# Altium schematic sheet 03 RK808.SchDoc
size 420 x 297 mm; Address1: Address1; Address2: Address2; Address3: Address3; Address4: Address4; DocumentNumber: АБВГ.123456.001 Э3; SheetNumber: 3; SheetTotal: 23; Scale: 1:1; DocumentType: Схема электрическая принципиальная; FirstReferrence: АБВГ.123456.001
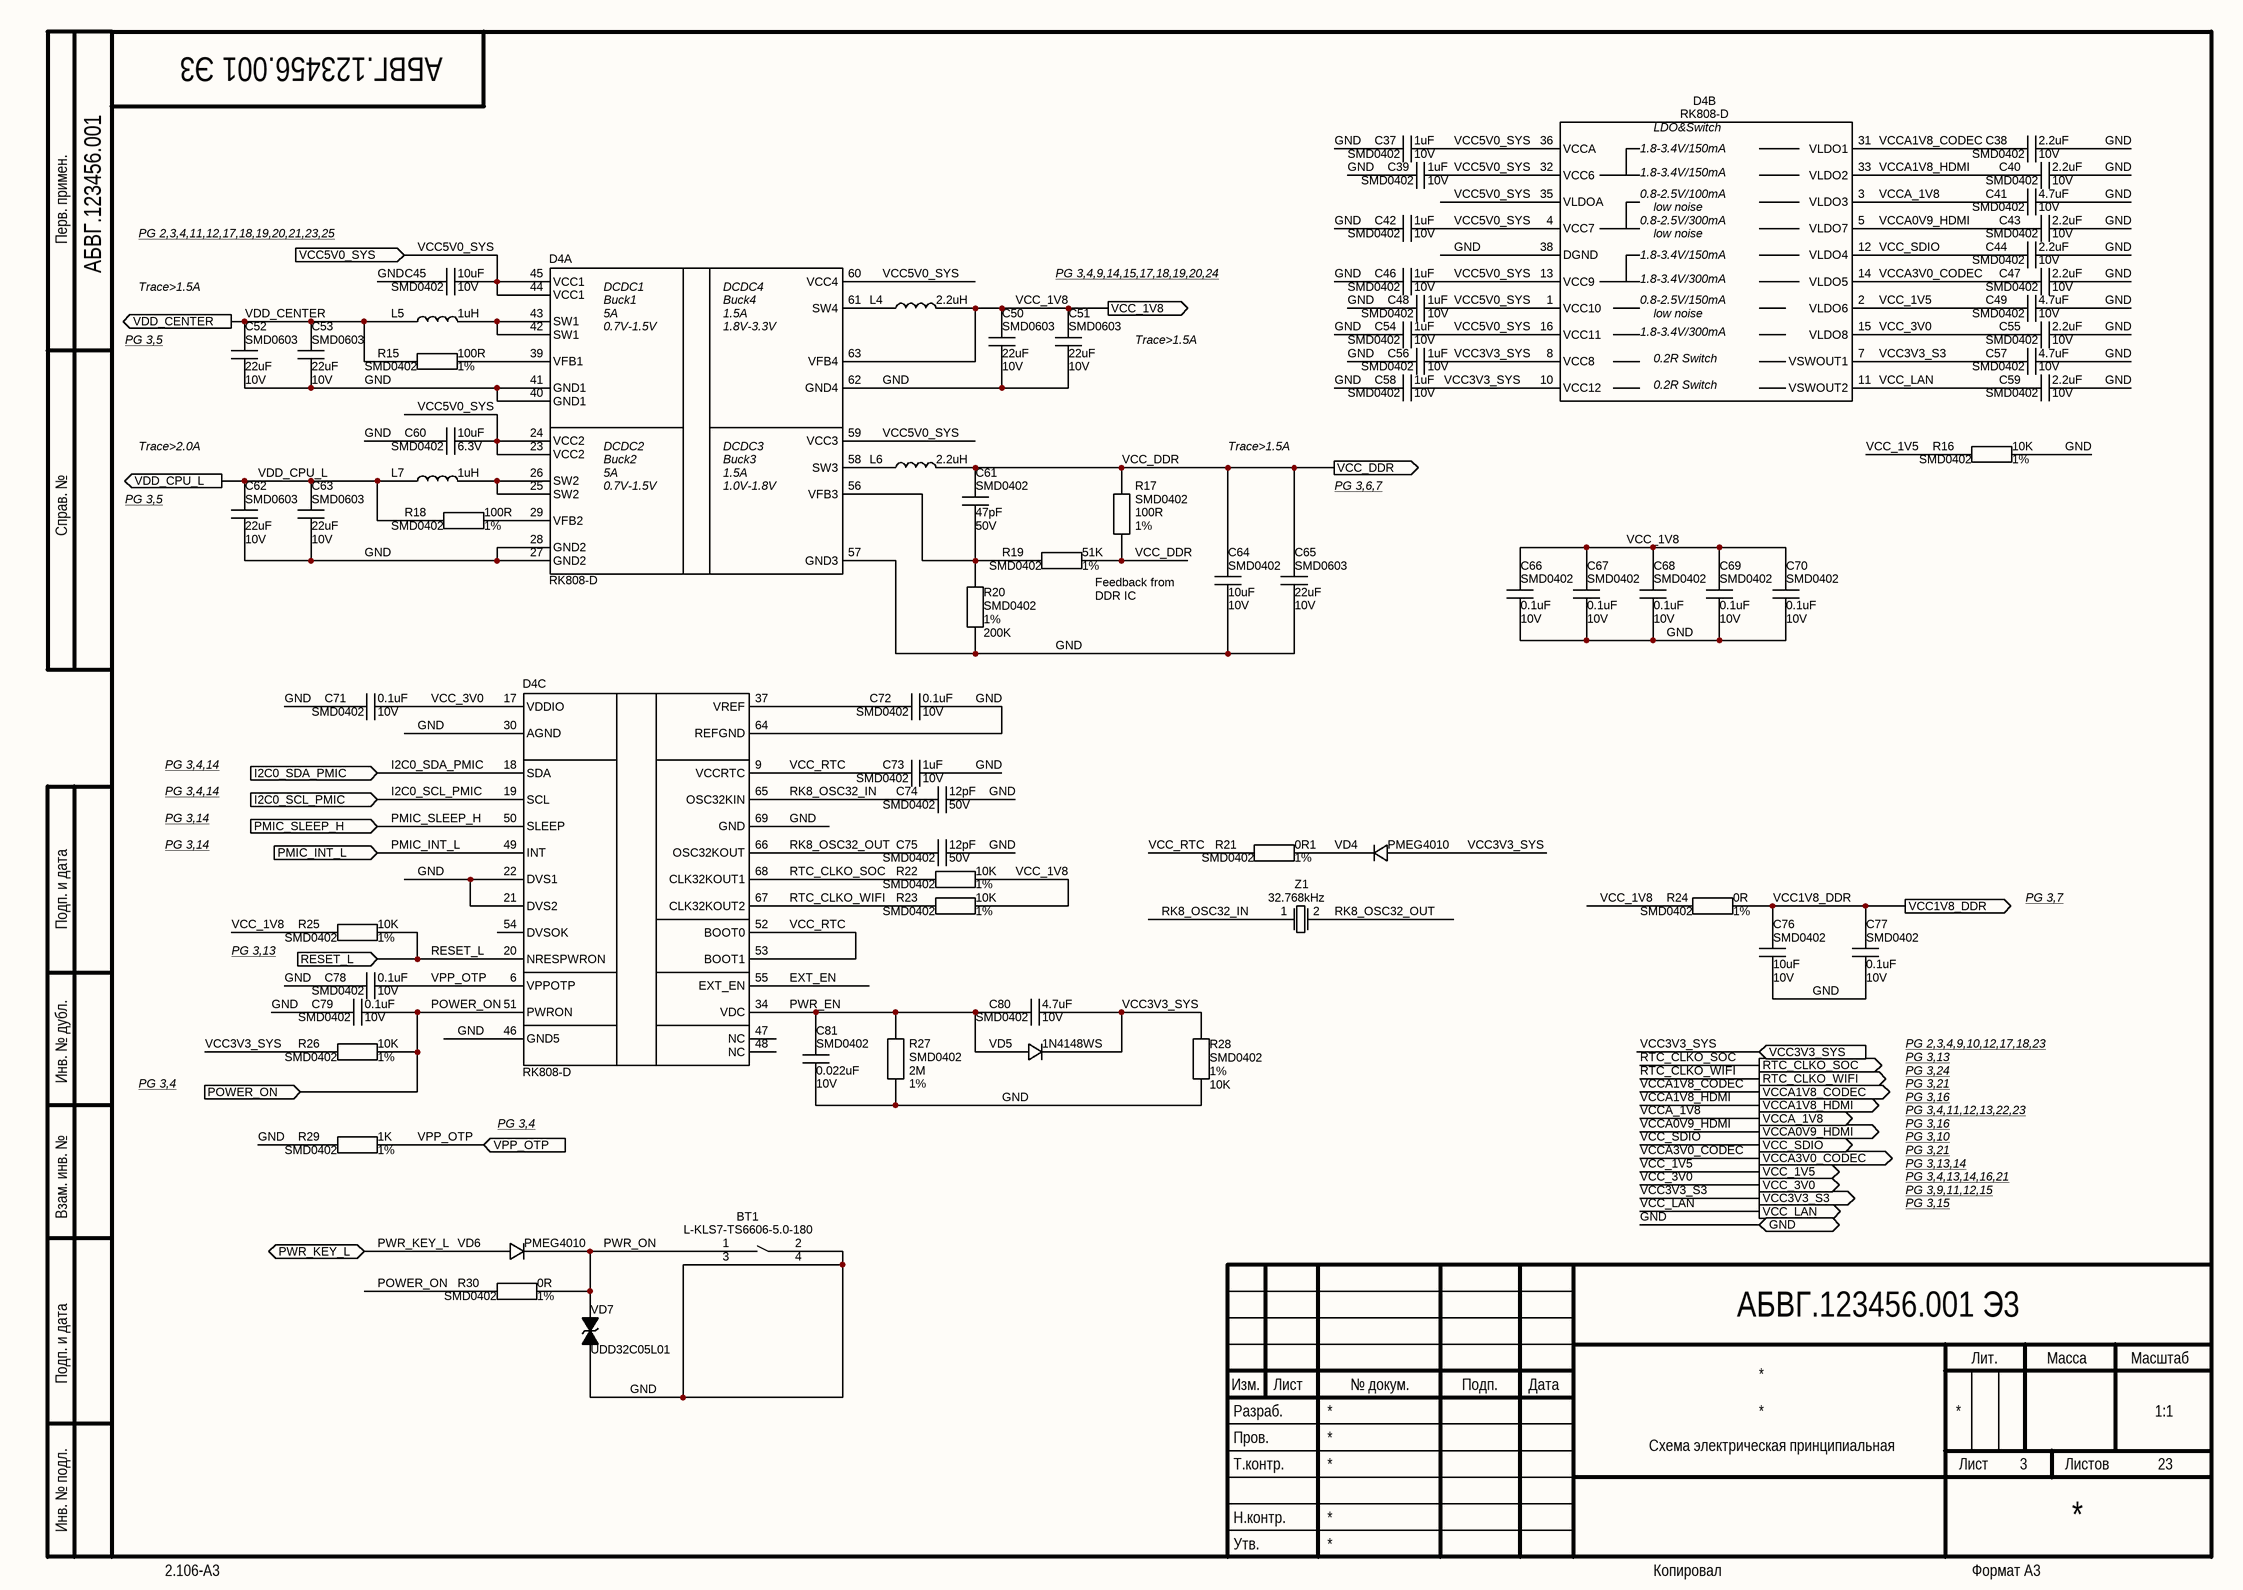
[diagram p0: 03 RK808.SchDoc]

## Parts
BT1  L-KLS7-TS6606-5.0-180  [L-KLS7-TS6606-5.0-180]
C37  Package: SMD0402  Voltage: 10V  [CAP_SMD_0402]  (hidden comment: 1uF)
C38  Package: SMD0402  Voltage: 10V  [CAP_SMD_0402]  (hidden comment: 2.2uF)
C39  Package: SMD0402  Voltage: 10V  [CAP_SMD_0402]  (hidden comment: 1uF)
C40  Package: SMD0402  Voltage: 10V  [CAP_SMD_0402]  (hidden comment: 2.2uF)
C41  Package: SMD0402  Voltage: 10V  [CAP_SMD_0402]  (hidden comment: 4.7uF)
C42  Package: SMD0402  Voltage: 10V  [CAP_SMD_0402]  (hidden comment: 1uF)
C43  Package: SMD0402  Voltage: 10V  [CAP_SMD_0402]  (hidden comment: 2.2uF)
C44  Package: SMD0402  Voltage: 10V  [CAP_SMD_0402]  (hidden comment: 2.2uF)
C45  Package: SMD0402  Voltage: 10V  [CAP_SMD_0402]  (hidden comment: 10uF)
C46  Package: SMD0402  Voltage: 10V  [CAP_SMD_0402]  (hidden comment: 1uF)
C47  Package: SMD0402  Voltage: 10V  [CAP_SMD_0402]  (hidden comment: 2.2uF)
C48  Package: SMD0402  Voltage: 10V  [CAP_SMD_0402]  (hidden comment: 1uF)
C49  Package: SMD0402  Voltage: 10V  [CAP_SMD_0402]  (hidden comment: 4.7uF)
C50  Package: SMD0603  Voltage: 10V  [CAP_SMD_0603]  (hidden comment: 22uF)
C51  Package: SMD0603  Voltage: 10V  [CAP_SMD_0603]  (hidden comment: 22uF)
C52  Package: SMD0603  Voltage: 10V  [CAP_SMD_0603]  (hidden comment: 22uF)
C53  Package: SMD0603  Voltage: 10V  [CAP_SMD_0603]  (hidden comment: 22uF)
C54  Package: SMD0402  Voltage: 10V  [CAP_SMD_0402]  (hidden comment: 1uF)
C55  Package: SMD0402  Voltage: 10V  [CAP_SMD_0402]  (hidden comment: 2.2uF)
C56  Package: SMD0402  Voltage: 10V  [CAP_SMD_0402]  (hidden comment: 1uF)
C57  Package: SMD0402  Voltage: 10V  [CAP_SMD_0402]  (hidden comment: 4.7uF)
C58  Package: SMD0402  Voltage: 10V  [CAP_SMD_0402]  (hidden comment: 1uF)
C59  Package: SMD0402  Voltage: 10V  [CAP_SMD_0402]  (hidden comment: 2.2uF)
C60  Package: SMD0402  Voltage: 6.3V  [CAP_SMD_0402]  (hidden comment: 10uF)
C61  Package: SMD0402  Voltage: 50V  [CAP_SMD_0402]  (hidden comment: 47pF)
C62  Package: SMD0603  Voltage: 10V  [CAP_SMD_0603]  (hidden comment: 22uF)
C63  Package: SMD0603  Voltage: 10V  [CAP_SMD_0603]  (hidden comment: 22uF)
C64  Package: SMD0402  Voltage: 10V  [CAP_SMD_0402]  (hidden comment: 10uF)
C65  Package: SMD0603  Voltage: 10V  [CAP_SMD_0603]  (hidden comment: 22uF)
C66  Package: SMD0402  Voltage: 10V  [CAP_SMD_0402]  (hidden comment: 0.1uF)
C67  Package: SMD0402  Voltage: 10V  [CAP_SMD_0402]  (hidden comment: 0.1uF)
C68  Package: SMD0402  Voltage: 10V  [CAP_SMD_0402]  (hidden comment: 0.1uF)
C69  Package: SMD0402  Voltage: 10V  [CAP_SMD_0402]  (hidden comment: 0.1uF)
C70  Package: SMD0402  Voltage: 10V  [CAP_SMD_0402]  (hidden comment: 0.1uF)
C71  Package: SMD0402  Voltage: 10V  [CAP_SMD_0402]  (hidden comment: 0.1uF)
C72  Package: SMD0402  Voltage: 10V  [CAP_SMD_0402]  (hidden comment: 0.1uF)
C73  Package: SMD0402  Voltage: 10V  [CAP_SMD_0402]  (hidden comment: 1uF)
C74  Package: SMD0402  Voltage: 50V  [CAP_SMD_0402]  (hidden comment: 12pF)
C75  Package: SMD0402  Voltage: 50V  [CAP_SMD_0402]  (hidden comment: 12pF)
C76  Package: SMD0402  Voltage: 10V  [CAP_SMD_0402]  (hidden comment: 10uF)
C77  Package: SMD0402  Voltage: 10V  [CAP_SMD_0402]  (hidden comment: 0.1uF)
C78  Package: SMD0402  Voltage: 10V  [CAP_SMD_0402]  (hidden comment: 0.1uF)
C79  Package: SMD0402  Voltage: 10V  [CAP_SMD_0402]  (hidden comment: 0.1uF)
C80  Package: SMD0402  Voltage: 10V  [CAP_SMD_0402]  (hidden comment: 4.7uF)
C81  Package: SMD0402  Voltage: 10V  [CAP_SMD_0402]  (hidden comment: 0.022uF)
D4  RK808-D  [QFN35P700X700X80-69N]  (parts A,B,C of 3)
L4  value 2.2uH  [HEI252012A]  (hidden comment: Value)
L5  value 1uH  [HEI252012A]  (hidden comment: Value)
L6  value 2.2uH  [HEI252012A]  (hidden comment: Value)
L7  value 1uH  [HEI252012A]  (hidden comment: Value)
R15  Package: SMD0402  Tolerance: 1%  [RES_SMD_0402]  (hidden comment: 100R)
R16  Package: SMD0402  Tolerance: 1%  [RES_SMD_0402]  (hidden comment: 10K)
R17  Package: SMD0402  Tolerance: 1%  [RES_SMD_0402]  (hidden comment: 100R)
R18  Package: SMD0402  Tolerance: 1%  [RES_SMD_0402]  (hidden comment: 100R)
R19  Package: SMD0402  Tolerance: 1%  [RES_SMD_0402]  (hidden comment: 51K)
R20  Package: SMD0402  Tolerance: 1%  [RES_SMD_0402]  (hidden comment: 200K)
R21  Package: SMD0402  Tolerance: 1%  [RES_SMD_0402]  (hidden comment: 0R1)
R22  Package: SMD0402  Tolerance: 1%  [RES_SMD_0402]  (hidden comment: 10K)
R23  Package: SMD0402  Tolerance: 1%  [RES_SMD_0402]  (hidden comment: 10K)
R24  Package: SMD0402  Tolerance: 1%  [RES_SMD_0402]  (hidden comment: 0R)
R25  Package: SMD0402  Tolerance: 1%  [RES_SMD_0402]  (hidden comment: 10K)
R26  Package: SMD0402  Tolerance: 1%  [RES_SMD_0402]  (hidden comment: 10K)
R27  Package: SMD0402  Tolerance: 1%  [RES_SMD_0402]  (hidden comment: 2M)
R28  Package: SMD0402  Tolerance: 1%  [RES_SMD_0402]  (hidden comment: 10K)
R29  Package: SMD0402  Tolerance: 1%  [RES_SMD_0402]  (hidden comment: 1K)
R30  Package: SMD0402  Tolerance: 1%  [RES_SMD_0402]  (hidden comment: 0R)
VD4  value PMEG4010  [SOD323]  (hidden comment: Diode)
VD5  value 1N4148WS  [SOD323]  (hidden comment: Diode)
VD6  value PMEG4010  [SOD323]  (hidden comment: Diode)
VD7  value UDD32C05L01  [SOD323]  (hidden comment: TVS_Diode)
Z1  value 32.768kHz  [TSX3215]  (hidden comment: Value)

## Ports
GND (bidir), I2C0_SCL_PMIC (in), I2C0_SDA_PMIC (in), PMIC_INT_L (in), PMIC_SLEEP_H (in), POWER_ON (in), PWR_KEY_L (bidir), RESET_L (in), RTC_CLKO_SOC (out), RTC_CLKO_WIFI (out), VCC1V8_DDR (out), VCC3V3_S3 (out), VCC3V3_SYS (in), VCC5V0_SYS (in), VCC_1V5 (out), VCC_1V8 (out), VCC_3V0 (out), VCC_DDR (out), VCC_LAN (out), VCC_SDIO (out), VCCA0V9_HDMI (out), VCCA1V8_CODEC (out), VCCA1V8_HDMI (out), VCCA3V0_CODEC (out), VCCA_1V8 (out), VDD_CENTER (out), VDD_CPU_L (out), VPP_OTP (in)

## Nets
EXT_EN: D4.55(EXT_EN)
GND: BT1.2 BT1.3 BT1.4 C37.2 C38.2 C39.2 C40.2 C41.2 C42.2 C43.2 C44.2 C45.1 C46.2 C47.2 C48.2 C49.2 C50.1 C51.1 C52.1 C53.1 C54.2 C55.2 C56.2 C57.2 C58.2 C59.2 C60.2 C62.1 C63.1 C64.2 C65.1 C66.2 C67.2 C68.2 C69.2 C70.2 C71.1 C72.2 C73.1 C74.1 C75.1 C76.2 C77.2 C78.1 C79.1 C81.2 D4.21(DVS2) D4.22(DVS1) D4.27(GND2) D4.28(GND2) D4.30(AGND) D4.38(DGND) D4.40(GND1) D4.41(GND1) D4.46(GND5) D4.57(GND3) D4.62(GND4) D4.64(REFGND) D4.69(GND) R16.1 R20.1 R27.1 R28.1 R29.1 VD7.1(A) ; port GND
I2C0_SCL_PMIC: D4.19(SCL) ; port I2C0_SCL_PMIC
I2C0_SDA_PMIC: D4.18(SDA) ; port I2C0_SDA_PMIC
PMIC_INT_L: D4.49(INT) ; port PMIC_INT_L
PMIC_SLEEP_H: D4.50(SLEEP) ; port PMIC_SLEEP_H
POWER_ON: C79.2 D4.51(PWRON) R26.1 R30.1 ; port POWER_ON
PWR_EN: C80.1 C81.1 D4.34(VDC) R27.2 VD5.1(A)
PWR_KEY_L: VD6.1(A) ; port PWR_KEY_L
PWR_ON: BT1.1 R30.2 VD6.2(C) VD7.2(C)
RESET_L: D4.20(NRESPWRON) R25.1 ; port RESET_L
RK8_OSC32_IN: C74.2 D4.65(OSC32KIN) Z1.1
RK8_OSC32_OUT: C75.2 D4.66(OSC32KOUT) Z1.2
RTC_CLKO_SOC: D4.68(CLK32KOUT1) R22.2 ; port RTC_CLKO_SOC
RTC_CLKO_WIFI: D4.67(CLK32KOUT2) R23.2 ; port RTC_CLKO_WIFI
VCC1V8_DDR: C76.1 C77.1 R24.2 ; port VCC1V8_DDR
VCC3V3_S3: C57.1 D4.7(VSWOUT1) ; port VCC3V3_S3
VCC3V3_SYS: C56.1 C58.1 C80.2 D4.8(VCC8) D4.10(VCC12) R26.2 R28.2 VD4.1(A) VD5.2(C) ; port VCC3V3_SYS
VCC5V0_SYS: C37.1 C39.1 C42.1 C45.2 C46.1 C48.1 C54.1 C60.1 D4.1(VCC10) D4.4(VCC7) D4.13(VCC9) D4.16(VCC11) D4.23(VCC2) D4.24(VCC2) D4.32(VCC6) D4.35(VLDOA) D4.36(VCCA) D4.44(VCC1) D4.45(VCC1) D4.59(VCC3) D4.60(VCC4) ; port VCC5V0_SYS
VCC_1V5: C49.1 D4.2(VLDO6) R16.2 ; port VCC_1V5
VCC_1V8: C50.2 C51.2 C66.1 C67.1 C68.1 C69.1 C70.1 D4.63(VFB4) L4.1 R22.1 R23.1 R24.1 R25.2 ; port VCC_1V8
VCC_3V0: C55.1 C71.2 D4.15(VLDO8) D4.17(VDDIO) ; port VCC_3V0
VCC_DDR: C61.1 C64.1 C65.2 L6.1 R17.1 R17.2 R19.1 ; port VCC_DDR
VCC_LAN: C59.1 D4.11(VSWOUT2) ; port VCC_LAN
VCC_RTC: C73.2 D4.9(VCCRTC) D4.52(BOOT0) D4.53(BOOT1) R21.1
VCC_SDIO: C44.1 D4.12(VLDO4) ; port VCC_SDIO
VCCA0V9_HDMI: C43.1 D4.5(VLDO7) ; port VCCA0V9_HDMI
VCCA1V8_CODEC: C38.1 D4.31(VLDO1) ; port VCCA1V8_CODEC
VCCA1V8_HDMI: C40.1 D4.33(VLDO2) ; port VCCA1V8_HDMI
VCCA3V0_CODEC: C47.1 D4.14(VLDO5) ; port VCCA3V0_CODEC
VCCA_1V8: C41.1 D4.3(VLDO3) ; port VCCA_1V8
VDD_CENTER: C52.2 C53.2 L5.2 R15.1 ; port VDD_CENTER
VDD_CPU_L: C62.2 C63.2 L7.2 R18.1 ; port VDD_CPU_L
VPP_OTP: C78.2 D4.6(VPPOTP) R29.2 ; port VPP_OTP
NetC61_2: C61.2 D4.56(VFB3) R19.2 R20.2
NetC72_1: C72.1 D4.37(VREF)
NetD4_25: D4.25(SW2) D4.26(SW2) L7.1
NetD4_29: D4.29(VFB2) R18.2
NetD4_39: D4.39(VFB1) R15.2
NetD4_42: D4.42(SW1) D4.43(SW1) L5.1
NetD4_58: D4.58(SW3) L6.2
NetD4_61: D4.61(SW4) L4.2
NetR21_2: R21.2 VD4.2(C)

Not connected (* = marked no-connect by the designer): D4 47(NC) 48(NC) 54(DVSOK)

## Notes on the sheet
- Перв. примен.
- PG 2,3,4,11,12,17,18,19,20,21,23,25
- Trace>1.5A
- PG 3,4,9,14,15,17,18,19,20,24
- PG 3,5
- Trace>2.0A
- Справ. №
- PG 3,6,7
- Feedback from
  DDR IC
- PG 3,4,14
- PG 3,14
- Подп. и дата
- PG 3,7
- PG 3,13
- PG 2,3,4,9,10,12,17,18,23
- Инв. № дубл.
- PG 3,4
- PG 3,24
- PG 3,21
- PG 3,16
- PG 3,4,11,12,13,22,23
- PG 3,10
- PG 3,13,14
- PG 3,4,13,14,16,21
- PG 3,9,11,12,15
- PG 3,15
- Взам. инв. №
- Разраб.
- Изм.
- Лист
- № докум.
- Подп.
- Дата
- Лит.
- Масса
- Масштаб
- Пров.
- Т.контр.
- Листов
- Инв. № подл.
- Утв.
- Н.контр.
- 2.106-A3
- Копировал
- Формат А3
- (in symbol RK808-D, part A) DCDC1; DCDC4; Buck1; Buck4; 5A; 1.5A; 0.7V-1.5V; 1.8V-3.3V; DCDC2; DCDC3; Buck2; Buck3; 1.0V-1.8V
- (in symbol RK808-D, part B) LDO&Switch; 1.8-3.4V/150mA; 0.8-2.5V/100mA; low noise; 0.8-2.5V/300mA; 1.8-3.4V/300mA; 0.8-2.5V/150mA; 0.2R Switch

## Library data of the parts
BT1 = Button_Corner_4pin: ComponentType: *; Manufacter: *; Package: L-KLS7-TS6606-5.0-180; PartNumber: L-KLS7-TS6606-5.0-180; ClassName: *; Value: L-KLS7-TS6606-5.0-180
C37 C39 C42 C46 C48 C54 C56 C58 C73 = Ceramic_Cap: PartNumber: CC0402KRX5R6BB105; ComponentType: SMD Ceramic Chip Capacitor; Manufacter: *; Tolerance: *; ClassName: *; Value: 1uF
C38 C40 C43 C44 C47 C55 C59 = Ceramic_Cap: PartNumber: CC0402KRX5R6BB225; ComponentType: SMD Ceramic Chip Capacitor; Manufacter: *; Tolerance: *; ClassName: *; Value: 2.2uF
C41 C49 C57 C80 = Ceramic_Cap: PartNumber: CL05A475KP5NRNC; ComponentType: SMD Ceramic Chip Capacitor; Manufacter: *; Tolerance: *; ClassName: *; Value: 4.7uF
C45 C60 C64 C76 = Ceramic_Cap: PartNumber: CC0402MRX5R6BB106; ComponentType: SMD Ceramic Chip Capacitor; Manufacter: *; Tolerance: *; ClassName: *; Value: 10uF
C50-C53 C62 C63 C65 = Ceramic_Cap: PartNumber: CL10A226MP8NUNE; ComponentType: SMD Ceramic Chip Capacitor; Manufacter: *; Tolerance: *; ClassName: *; Value: 22uF
C61 = Ceramic_Cap: PartNumber: CC0402FRNPO9BN470; ComponentType: SMD Ceramic Chip Capacitor; Manufacter: *; Tolerance: *; ClassName: *; Value: 47pF
C66-C72 C77-C79 = Ceramic_Cap: PartNumber: CC0402KRX5R6BB104; ComponentType: SMD Ceramic Chip Capacitor; Manufacter: *; Tolerance: *; ClassName: *; Value: 0.1uF
C74 C75 = Ceramic_Cap: PartNumber: CC0402JRNPO9BN120; ComponentType: SMD Ceramic Chip Capacitor; Manufacter: *; Tolerance: *; ClassName: *; Value: 12pF
C81 = Ceramic_Cap: PartNumber: GRM155R61A223KA01D; ComponentType: SMD Ceramic Chip Capacitor; Manufacter: *; Tolerance: *; ClassName: *; Value: 0.022uF
L4 L6 = Inductor_smal: PartNumber: HEI252012A-2R2M-Q8; ComponentType: *; Manufacter: *; Package: HEI252012A; ClassName: *
L5 L7 = Inductor_smal: PartNumber: HEI252012A-1R0M-Q8; ComponentType: *; Manufacter: *; Package: HEI252012A; ClassName: *
R15 R17 R18 = Chip_Res: PartNumber: RC0402FR-07100RL; ComponentType: SMD Chip Resistor; Manufacter: *; Voltage: *; ClassName: *; Value: 100R
R16 R22 R23 R25 R26 R28 = Chip_Res: PartNumber: RC0402FR-0710KL; ComponentType: SMD Chip Resistor; Manufacter: *; Voltage: *; ClassName: *; Value: 10K
R19 = Chip_Res: PartNumber: RC0402FR-0751KL; ComponentType: SMD Chip Resistor; Manufacter: *; Voltage: *; ClassName: *; Value: 51K
R20 = Chip_Res: PartNumber: RC0402FR-07200KL; ComponentType: SMD Chip Resistor; Manufacter: *; Voltage: *; ClassName: *; Value: 200K
R21 = Chip_Res: PartNumber: RL0402FR-070R1L; ComponentType: SMD Chip Resistor; Manufacter: *; Voltage: *; ClassName: *; Value: 0R1
R24 R30 = Chip_Res: PartNumber: RC0402FR-070RL; ComponentType: SMD Chip Resistor; Manufacter: *; Voltage: *; ClassName: *; Value: 0R
R27 = Chip_Res: PartNumber: RC0402FR-072ML; ComponentType: SMD Chip Resistor; Manufacter: *; Voltage: *; ClassName: *; Value: 2M
R29 = Chip_Res: PartNumber: RC0402FR-071KL; ComponentType: SMD Chip Resistor; Manufacter: *; Voltage: *; ClassName: *; Value: 1K
VD4 VD6 = Diode: PartNumber: PMEG4010CEJ.115; ComponentType: *; Manufacter: *; Package: SOD323; ClassName: *
Z1 = OSC3215: PartNumber: SJK-7L-32.768-12.5-20-70-C; ComponentType: *; Manufacter: *; Package: TSX3215
D4 = RK808-D: ComponentType: SMD Chip Resistor; Manufacter: *; Voltage: *; ClassName: *; Tolerance: *; PartNumber: RK808-D; Package: QFN68; Value: RK808-D
VD5 = Diode: ComponentType: *; Manufacter: *; Package: SOD323; PartNumber: 1N4148WS; ClassName: *
VD7 = TVS_Diode: ComponentType: *; Manufacter: *; Package: SOD323; PartNumber: UDD32C05L01; ClassName: *